# EAGLE design Franzininho (EAGLE 7.5.0)
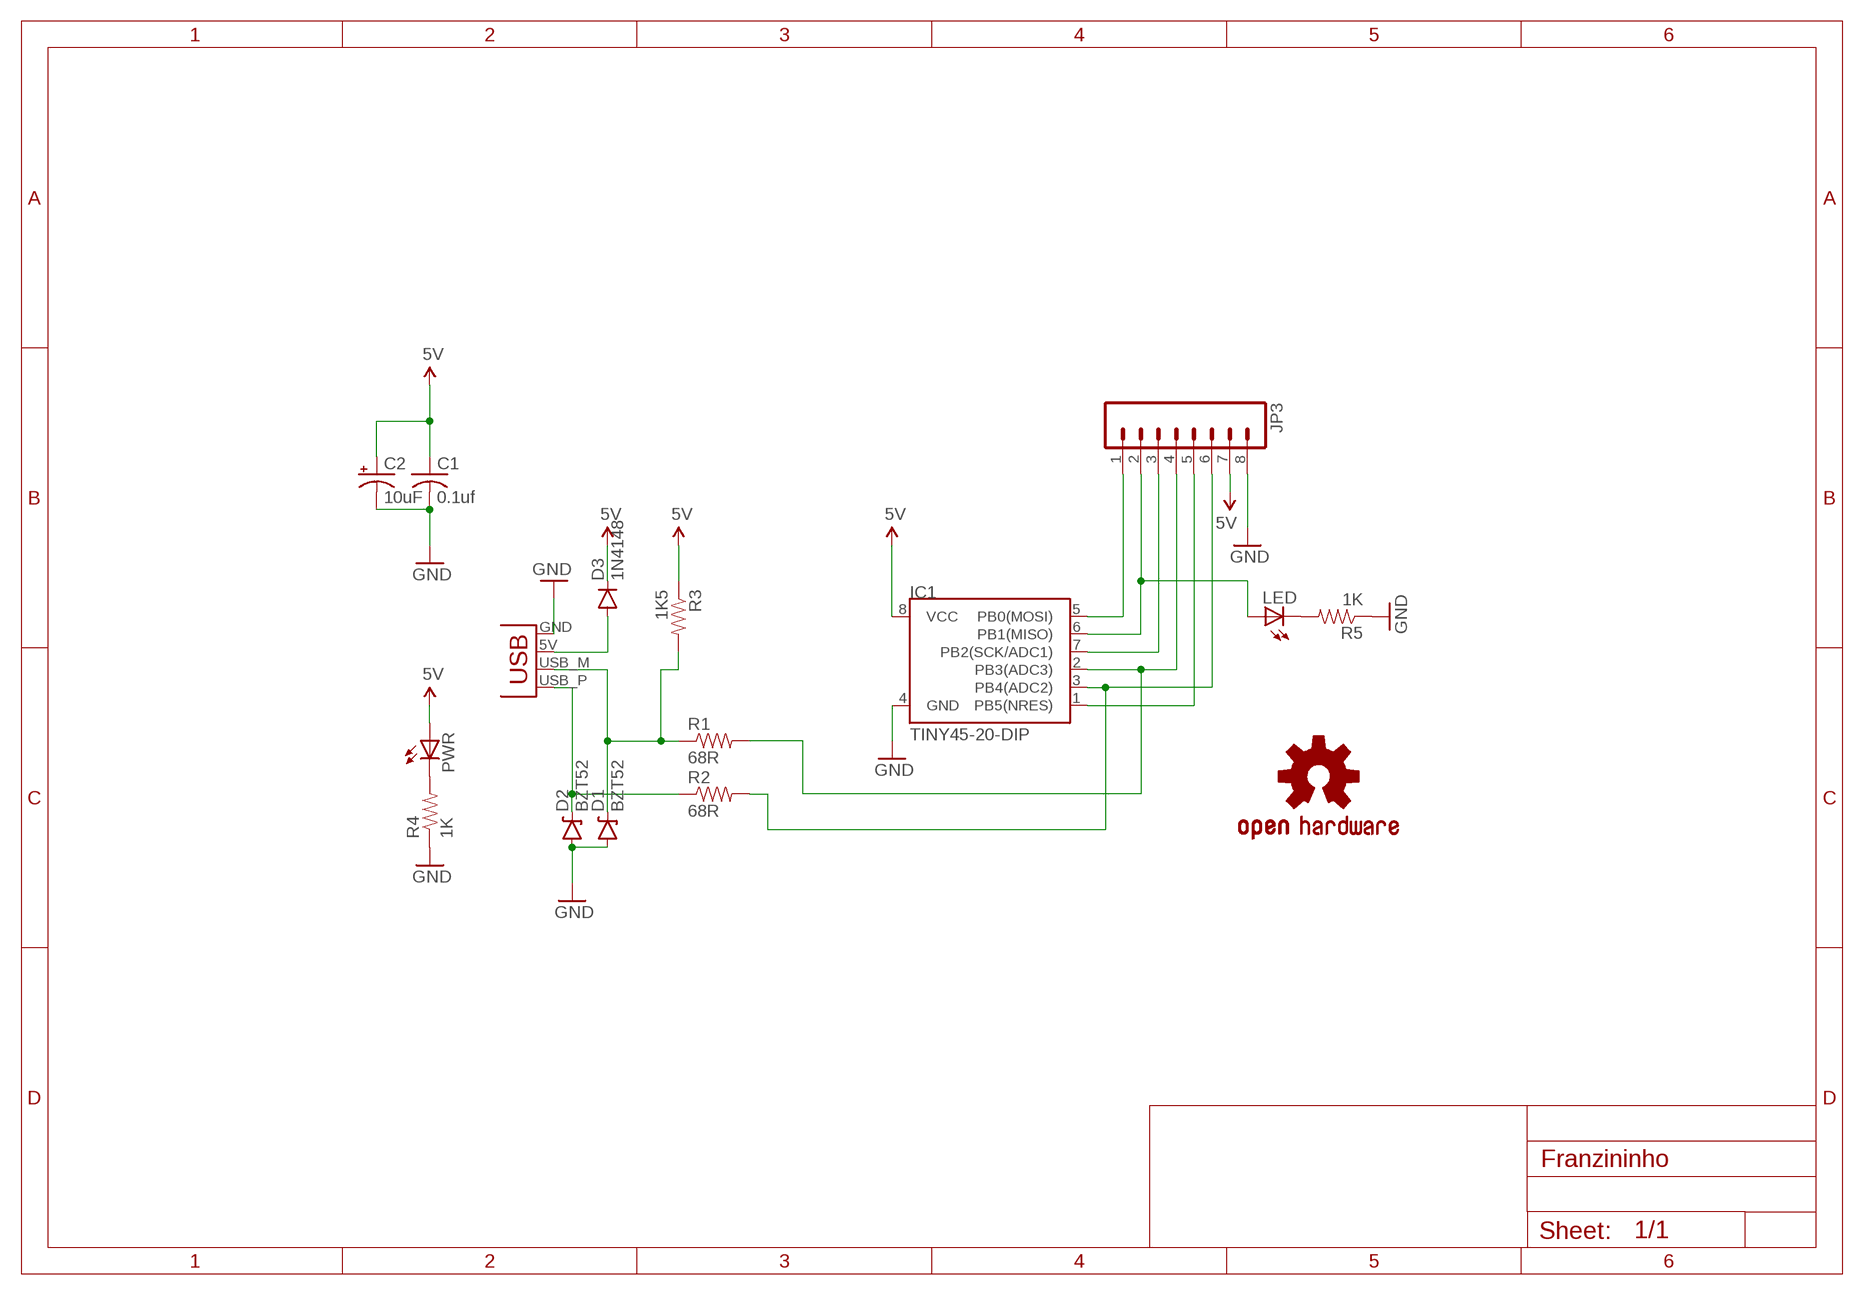
[diagram p0: schematic, sheet 1]

## Parts
C1  0.1uf  C-US025-025X050  [C025-025X050]
C2  10uF  CPOL-USE2,5-6E  [E2,5-6E]
D1  BZT52  DIODE-ZENER  [DIODE-BZT52]
D2  BZT52  DIODE-ZENER  [DIODE-BZT52]
D3  1N4148  DIODE1N4148  [DIODE-1N4148]
IC1  TINY45-20-DIP  ATTINY45TINY45-20-DIP  [DIP08]
JP3  M08  [1X08_ROUND]
LED  LED3MM  [LED3MM]
LOGO1  OSHW-LOGOL  [OSHW-LOGO-L]
PWR  LED3MM  [LED3MM]
R1  68R  RESISTORPTH-1/4W  [AXIAL-0.4]
R2  68R  RESISTORPTH-1/4W  [AXIAL-0.4]
R3  1K5  RESISTORPTH-1/4W  [AXIAL-0.4]
R4  1K  RESISTORPTH-1/4W  [AXIAL-0.4]
R5  1K  RESISTORPTH-1/4W  [AXIAL-0.4]
X1  USBPCB  [USB-A-PCB]

## Nets
5V: C1.1 C2.+ D3.C IC1.8(VCC) JP3.7 PWR.A R3.P$1
GND: C1.2 C2.- D1.A D2.A IC1.4(GND) JP3.8 R4.P$1 R5.P$1 X1.GND
N$1: IC1.2(PB3(ADC3)) JP3.4 R1.P$2
N$2: IC1.6(PB1(MISO)) JP3.2 LED.A
N$3: IC1.5(PB0(MOSI)) JP3.1
N$4: D3.A X1.5V(VBUS)
N$5: IC1.7(PB2(SCK/ADC1)) JP3.3
N$6: IC1.3(PB4(ADC2)) JP3.6 R2.P$2
N$8: IC1.1(PB5(NRES)) JP3.5
N$10: D1.C R1.P$1 R3.P$2 X1.USB_M(D-)
N$11: D2.C R2.P$1 X1.USB_P(D+)
N$12: LED.K(C) R5.P$2
N$17: PWR.K(C) R4.P$2

## Library data of the parts
C1 = adafruit:C-US: CAPACITOR, American symbol
C2 = adafruit:CPOL-US: POLARIZED CAPACITOR, American symbol
D1 D2 = SparkFun-DiscreteSemi:DIODE-ZENER: Zener Diode Production Part - 8199 3.4V Zener Voltage; PROD-ID: DIO-08199
D3 = SparkFun-DiscreteSemi:DIODE: Diode These are standard reverse protection diodes and small signal diodes. SMA package can handle up to about 1A. SOD-323 can handle about 200mA. What the SOD-323 package when ordering, there are some mfgs out there that are 5-pin packages.; PROD_ID: DIO-08378
IC1 = SparkFun-DigitalIC:ATTINY45: Atmel 8-pin 2/4/8kB flash uC; PROD_ID: IC-09439
JP3 = SparkFun-Connectors:M08: Header 8 Standard 8-pin 0.1" header. Use with straight break away headers (SKU : PRT-00116), right angle break away headers (PRT-00553), swiss pins (PRT-00743), machine pins (PRT-00117), and female headers (PRT-00115).; PROD_ID: CONN-08437
LED PWR = adafruit:LED: LED OSRAM: - CHIPLED LG R971, LG N971, LY N971, LG Q971, LY Q971, LO R971, LY R971 LH N974, LH R974 LS Q976, LO Q976, LY Q976 LO Q996 - Hyper CHIPLED LW Q18S LB Q993, LB Q99A, LB R99A - SideLED LS A670, LO A670, LY A670, LG A670, LP A670 LB A673, LV A673, LT A673, LW A673 LH A674 LY A675 LS A676, LA A676, LO A676, LY A676, LW A676 LS A679, LY A679, LG A679 - Hyper Micro SIDELED® LS Y876, LA Y876, LO Y876, LY Y876 LT Y87S - SmartLED LW L88C, LW L88S LB L89C, LB L89S, LG L890 LS L89K, LO L89K, LY L89K LS L896, LA L896, LO L896, LY L896 - TOPLED LS T670, LO T670, LY T670, LG T670, LP T670 LSG T670, LSP T670, LSY T670, LOP T670, LYG T670 LG T671, LOG T671, LSG T671 LB T673, LV T673, LT T673, LW T673 LH T674 LS T676, LA T676, LO T676, LY T676, LB T676, LH T676, LSB T676, LW T676 LB T67C, LV T67C, LT T67C, LS T67K, LO T67K, LY T67K, LW E67C LS E67B, LA E67B, LO E67B, LY E67B, LB E67C, LV E67C, LT E67C LW T67C LS T679, LY T679, LG T679 LS T770, LO T770, LY T770, LG T770, LP T770 LB T773, LV T773, LT T773, LW T773 LH T774 LS E675, LA E675, LY E675, LS T675 LS T776, LA T776, LO T776, LY T776, LB T776 LHGB T686 LT T68C, LB T68C - Hyper Mini TOPLED® LB M676 - Mini TOPLED Santana® LG M470 LS M47K, LO M47K, LY M47K Source: http://www.osram.convergy.de/
LOGO1 = SparkFun-Aesthetics:OSHW-LOGO: Open Source Hardware Logo This logo indicates the piece of hardware it is found on incorporates a OSHW license and/or adheres to the definition of open source hardware found here: http://freedomdefined.org/OSHW
R1-R5 = SparkFun-Passives:RESISTOR: Resistor Basic schematic elements and footprints for 0603, 1206, and PTH resistors.
X1 = SparkFun:USB: USB Connectors USB-B-PTH is fully proven SKU : PRT-00139 USB-miniB is fully proven SKU : PRT-00587 USB-A-PCB is untested. USB-A-H is throughly reviewed, but untested. Spark Fun Electronics SKU : PRT-00437 USB-B-SMT is throughly reviewed, but untested. Needs silkscreen touching up. USB-A-S has not been used/tested USB-MB-H has not been used/tested

## Board
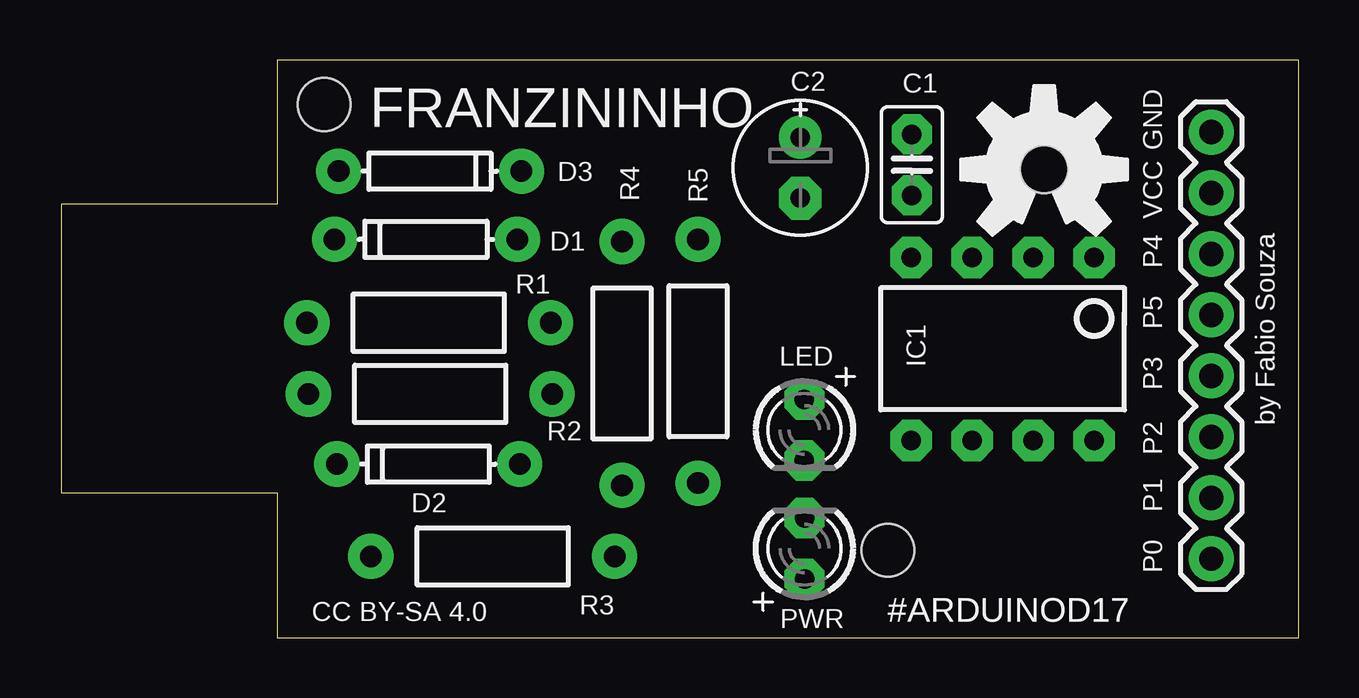
[diagram p1: board, top side]
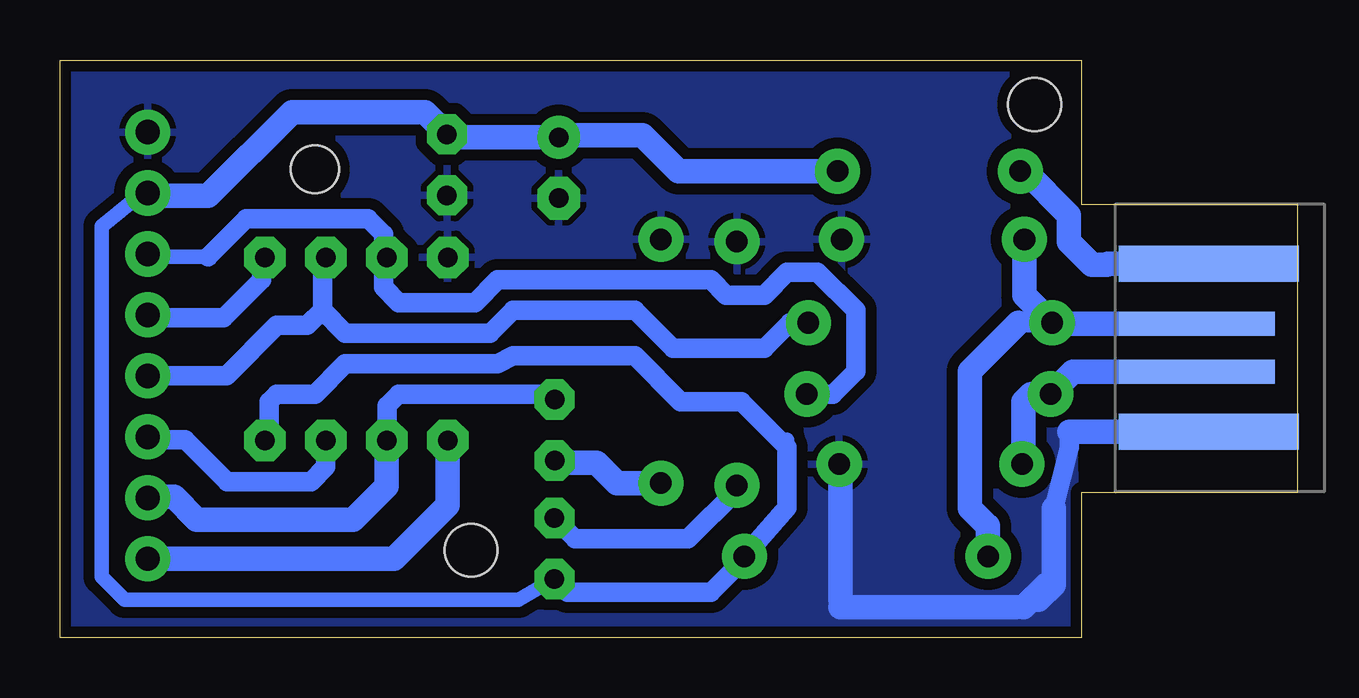
[diagram p2: board, bottom side, seen from below]

Size 51.58 x 24.08 mm. Coordinates in mm from the lower left corner, seen from the top.
Outline: 0,6.04 9,6.04 9,0 51.58,0 51.58,24.08 9,24.08 9,18.07 0,18.07 0,6.04
Copper layers (1*16): Top 0.0356mm / dielectric 1.5011mm / Bottom 0.0356mm
Design rules "default *": minimum track width 8mil, minimum drill 13mil, track to track 12mil, track to pad 12mil, pad to pad 12mil, via to via 12mil, smd to smd 8mil, copper to edge 15mil, drill to drill 15mil, minimum pad ring 7mil, minimum via ring 7mil, stop-mask expansion 4mil, vias tented up to drill 25mil, thermal gap 10mil
Holes 2.2 mm at 10.95,22.23 34.45,3.65
Holes 2 mm at 40.96,19.53

### Footprints (pad centres in the part's own frame; a part is rotated, then mirrored left to right if it is on the bottom)
C025-025X050 = drill 0.813 pad 1.676 octagon: 1 -1.27,0; 2 1.27,0
E2,5-6E = drill 0.813 pad 1.778: + -1.27,0 | drill 0.813 pad 1.778 octagon: - 1.27,0
DIODE-BZT52 = drill 0.9 pad 1.88: A -3.81,0; C 3.81,0
DIODE-1N4148 = drill 0.9 pad 1.88: A -3.81,0; C 3.81,0
DIP08 = drill 0.813 pad 1.727 octagon: 1 -3.81,-3.81; 2 -1.27,-3.81; 3 1.27,-3.81; 4 3.81,-3.81; 5 3.81,3.81; 6 1.27,3.81; 7 -1.27,3.81; 8 -3.81,3.81
1X08_ROUND = drill 1.016 pad 1.88: 1 0,0; 2 2.54,0; 3 5.08,0; 4 7.62,0; 5 10.16,0; 6 12.7,0; 7 15.24,0; 8 17.78,0
LED3MM = drill 0.813 pad 1.676 octagon: A -1.27,0; K 1.27,0
AXIAL-0.4 = drill 0.9 pad 1.88: P$1 -5.08,0; P$2 5.08,0
USB-A-PCB = smd 7.5 x 1.5: 5V -0.2,-3.5; GND -0.2,3.5 | smd 6.5 x 1: USB_M 0.3,-1; USB_P 0.3,1

### Placement (x,y rotation side)
C1  35.45,19.71 270 top
C2  30.8,19.59 270 top
D1  15.19,16.61 180 top
D2  15.29,7.24 180 top
D3  15.36,19.45 0 top
IC1  39.23,12.04 180 top
JP3  47.93,3.3 90 top
LED  30.97,8.67 270 top
LOGO1  40.96,19.53 0 top
PWR  30.97,3.73 90 top
R1  15.31,13.13 0 top
R2  15.37,10.17 0 top
R3  17.98,3.4 180 top
R4  23.37,11.44 270 top
R5  26.53,11.53 270 top
X1  3.89,12.09 180 bottom

### Tracks (layer width: path | path; a pad name or v marks a point on that pad's centre or on a via)
5V
  Bottom 0.406: D3.C 19.13,19.45 19.05,19.37 | 48.28,18.41 JP3.7
  Bottom 0.61: 21.27,8.26 21.27,7.94 | 48.28,18.41 49.85,17.14 49.85,2.54 48.9,1.59 32.48,1.59 PWR.A
  Bottom 0.813: 30.7,20.95 C2.+ | 35.33,20.86 C1.1 | IC1.8 42.86,8.41 42.86,9.84 42.55,10.16 40.96,10.16 39.69,11.43 33.34,11.43 32.7,11.75 27.62,11.75 25.72,9.84 23.18,9.84 21.27,7.94 21.27,5.42 R3.P$1 23.06,3.3 24.45,1.91 30.42,1.91 PWR.A
  Bottom 1.016: 48.28,18.41 45.4,18.41 41.91,21.91 36.37,21.91 C1.1 | D3.C 25.8,19.45 27.3,20.95 30.7,20.95 | C2.+ 35.33,20.86
GND
  Bottom 0.406: 19.05,1.27 19.05,1.59 | 19.05,7.19 D2.A
  Bottom 0.813: 9.51,8.59 9.51,7.96 10.16,5.4
  Bottom 1.016: X1.GND 9.51,8.59 | 11.75,1.27 19.05,1.27 | 19.05,1.59 19.05,7.19 | 10.16,5.4 10.16,2.22 | 10.79,1.59 10.16,2.22 | 10.16,2.22 10.48,2.22 11.43,1.27
  pour Bottom (isolate 0.457): 9.53,23.81 51.59,23.81 51.59,0.16 9.21,0.32
N$1
  Bottom 0.813: 40.64,13.65 39.69,12.7 33.66,12.7 32.7,13.65 27.62,13.65 26.04,12.06 22.23,12.06 21.16,13.13 R1.P$2 | 40.64,13.65 40.64,15.71 IC1.2 | JP3.4 44.65,10.92 42.55,13.02 41.27,13.02 40.64,13.65
N$2
  Bottom 0.406: 37.94,8.25 IC1.6
  Bottom 0.813: 37.94,8.25 37.94,9.68 37.47,10.16 31.19,10.16
  Bottom 1.016: IC1.6 37.96,6.33 39.37,4.92 45.88,4.92 46.83,5.87 47.89,5.87 JP3.2 | 31.19,10.16 LED.A
N$3
  Bottom 1.016: IC1.5 35.42,5.54 37.66,3.3 JP3.1
N$4
  Bottom 0.813: D3.A 11.35,19.45 | 5.87,15.4 6.03,15.56 7.94,15.56 7.91,15.59
  Bottom 1.016: 11.35,19.45 9.53,17.62 9.53,16.51 8.57,15.56 7.94,15.56 | X1.5V 7.91,15.59
N$5
  Bottom 0.813: IC1.7 40.5,7.12 41.12,6.51 44.61,6.51 46.35,8.26 47.8,8.26 JP3.3
N$6
  Bottom 0.406: 38.1,15.71 IC1.3 | 47.8,15.88 JP3.6
  Bottom 0.61: 45.4,15.88 47.8,15.88 | R2.P$2
  Bottom 0.813: 45.4,15.88 43.81,17.46 38.73,17.46 38.1,16.83 38.1,15.71 38.1,14.61 37.47,13.97 34.29,13.97 33.34,14.92 24.45,14.92 23.81,14.29 22.23,14.29 21.27,15.24 20,15.24 18.41,13.65 18.41,11.11 19.37,10.16 R2.P$2
N$8
  Bottom 0.61: 47.8,13.34 JP3.5 | IC1.1 43.18,15.71
  Bottom 0.813: 43.18,15.71 43.18,14.92 44.77,13.34 47.8,13.34
N$10
  Bottom 0.406: 10.19,13.09 R1.P$1 | 13.02,4.76 12.99,4.76 12.9,4.67
  Bottom 0.813: R1.P$1 11.63,13.13
  Bottom 1.016: X1.USB_M 10.19,13.09 | D1.C 11.38,14.29 R1.P$1 | 11.63,13.13 13.65,11.11 13.65,5.4 13.02,4.76 | R3.P$2 12.9,4.67
N$11
  Bottom 0.61: R2.P$1 10.29,10.03 | 11.43,7.3 D2.C
  Bottom 1.016: X1.USB_P 9.37,11.09 R2.P$1 11.11,10.16 11.43,9.84 11.43,7.3
N$12
  Bottom 0.813: 30.87,7.3 LED.K
  Bottom 1.016: R5.P$2 28.36,6.45 29.21,7.3 30.87,7.3
N$17
  Bottom 0.406: R4.P$2 23.37,6.16
  Bottom 0.813: 23.37,6.16 25.4,4.13 30.1,4.13 PWR.K

### Text on the board
tNames: FRANZININHO | GND | VCC | by Fabio Souza | P4 | P5 | P3 | P2 | P1 | P0 | #ARDUINOD17 | #ARDUINOD17 | CC BY-SA 4.0